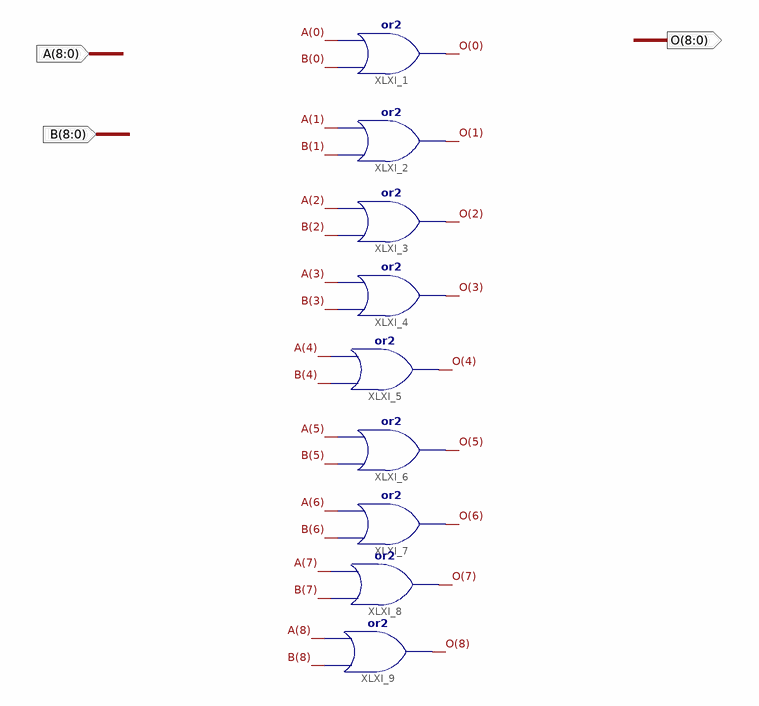
[diagram p0: schematic sheet 1]
// Xilinx ISE schematic Or16_8.sch (spartan6) as structural Verilog: 9 symbols, 3 ports
module Or16_8 (
  input  [8:0] A,
  input  [8:0] B,
  output [8:0] O
);

  or XLXI_1 (O[0], B[0], A[0]);
  or XLXI_2 (O[1], B[1], A[1]);
  or XLXI_3 (O[2], B[2], A[2]);
  or XLXI_4 (O[3], B[3], A[3]);
  or XLXI_5 (O[4], B[4], A[4]);
  or XLXI_6 (O[5], B[5], A[5]);
  or XLXI_7 (O[6], B[6], A[6]);
  or XLXI_8 (O[7], B[7], A[7]);
  or XLXI_9 (O[8], B[8], A[8]);
endmodule
